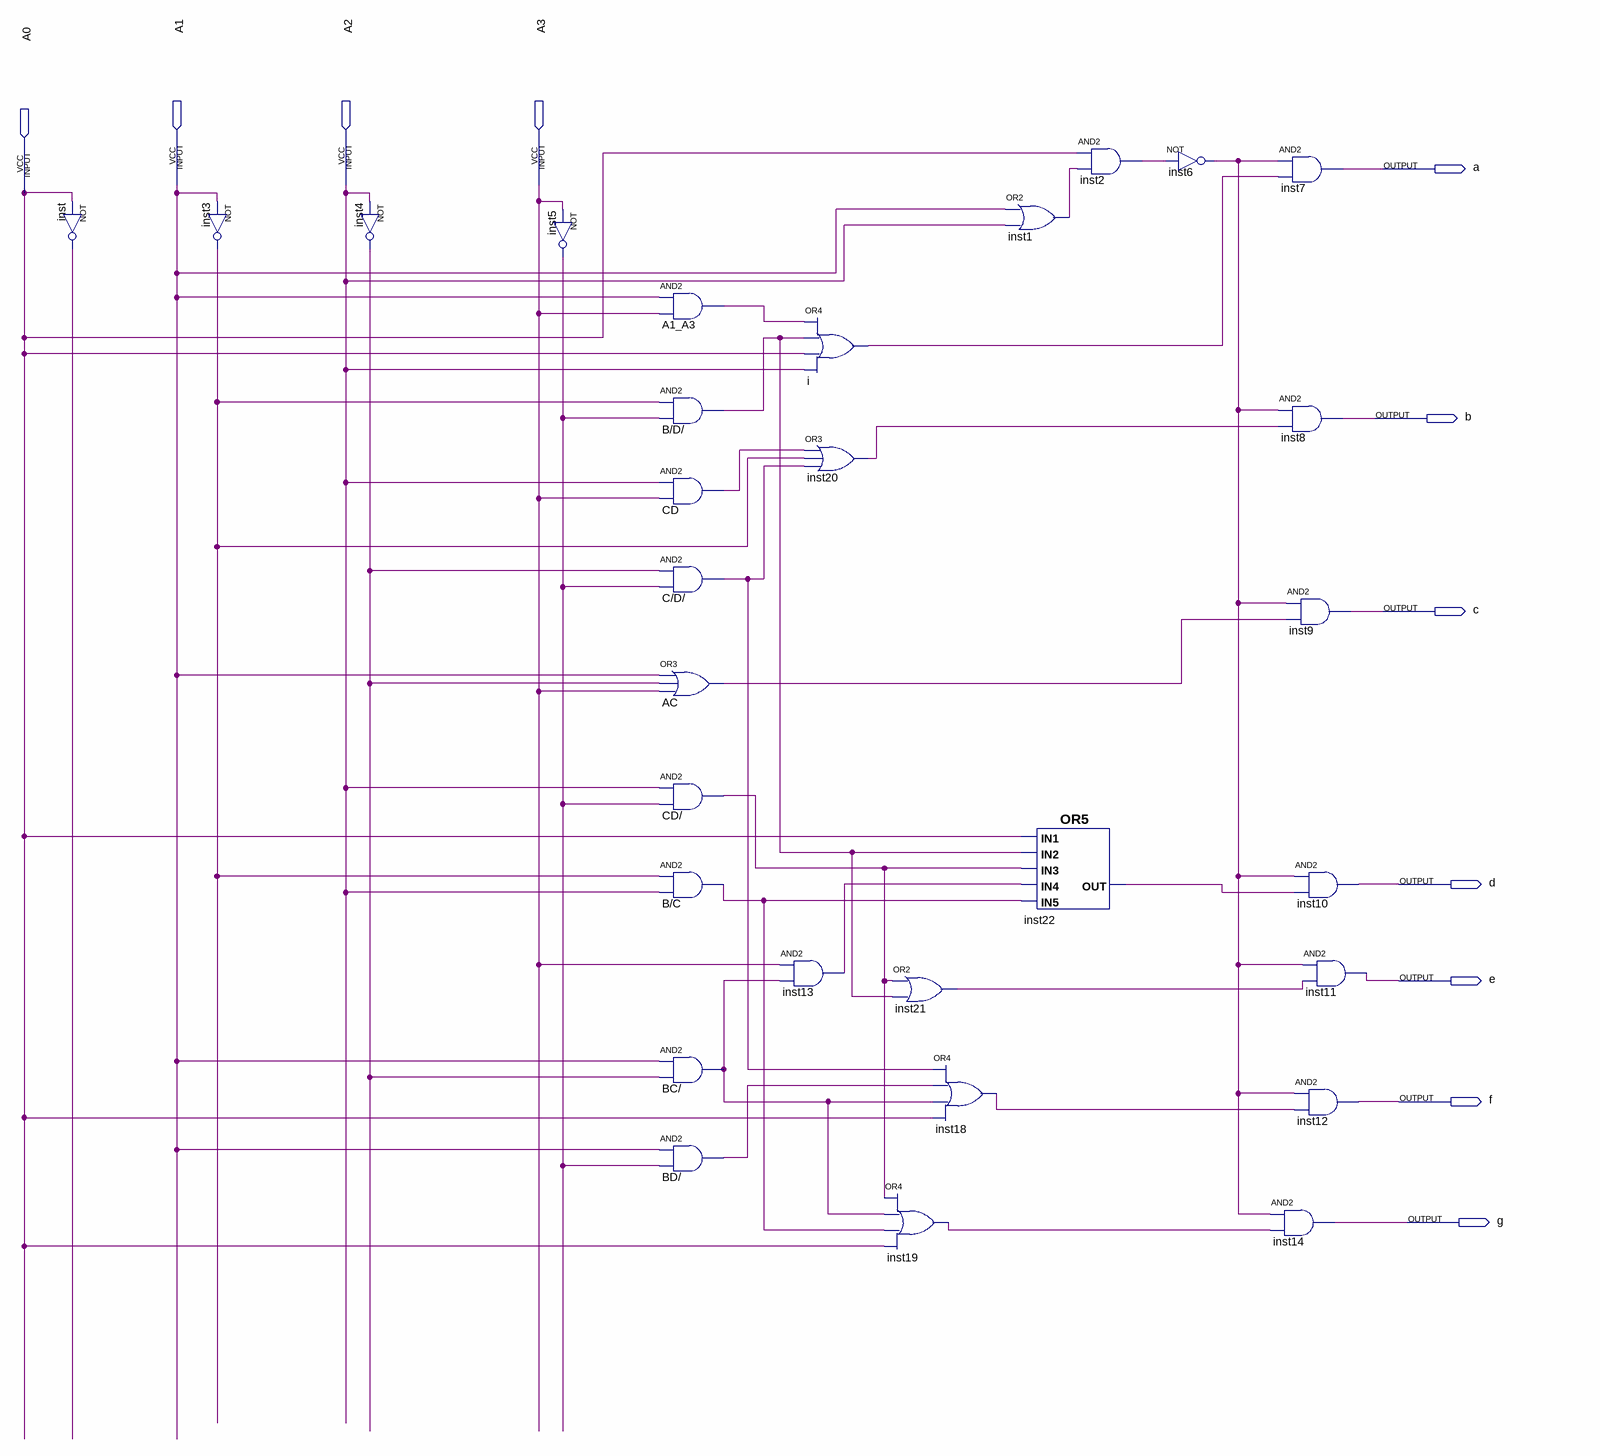
[diagram p0: schematic sheet]
// Quartus schematic Affich.bdf as structural Verilog: 30 symbols, 11 pins
module Affich (
  input  A1,
  input  A2,
  input  A3,
  input  A0,
  output a,
  output b,
  output c,
  output d,
  output e,
  output f,
  output g
);

  wire A1_A3_out, AC_out, B_C_out, B_D__out, BC__out, BD__out, C_D__out, CD__out, CD_out, i_out, inst1_out,
       inst2_out, inst3_out, inst4_out, inst5_out, inst6_out, inst13_out, inst18_out, inst19_out, inst20_out,
       inst21_out, inst22_out, inst_out;

  not inst (inst_out, A0);
  not inst3 (inst3_out, A1);
  not inst4 (inst4_out, A2);
  not inst5 (inst5_out, A3);
  and A1_A3 (A1_A3_out, A1, A3);
  and \B/D/  (B_D__out, inst3_out, inst5_out);
  and CD (CD_out, A2, A3);
  and \C/D/  (C_D__out, inst4_out, inst5_out);
  or AC (AC_out, A1, inst4_out, A3);
  and \CD/  (CD__out, A2, inst5_out);
  and \B/C  (B_C_out, inst3_out, A2);
  and \BC/  (BC__out, A1, inst4_out);
  and \BD/  (BD__out, A1, inst5_out);
  or i (i_out, A1_A3_out, B_D__out, A0, A2);
  or inst20 (inst20_out, CD_out, inst3_out, C_D__out);
  and inst13 (inst13_out, A3, BC__out);
  or inst21 (inst21_out, CD__out, B_D__out);
  or inst19 (inst19_out, CD__out, BC__out, B_C_out, A0);
  or inst18 (inst18_out, C_D__out, BD__out, BC__out, A0);
  or inst1 (inst1_out, A1, A2);
  or inst22 (inst22_out, A0, B_D__out, CD__out, inst13_out, B_C_out);
  and inst2 (inst2_out, A0, inst1_out);
  not inst6 (inst6_out, inst2_out);
  and inst7 (a, inst6_out, i_out);
  and inst8 (b, inst6_out, inst20_out);
  and inst14 (g, inst6_out, inst19_out);
  and inst9 (c, inst6_out, AC_out);
  and inst10 (d, inst6_out, inst22_out);
  and inst11 (e, inst6_out, inst21_out);
  and inst12 (f, inst6_out, inst18_out);
endmodule
